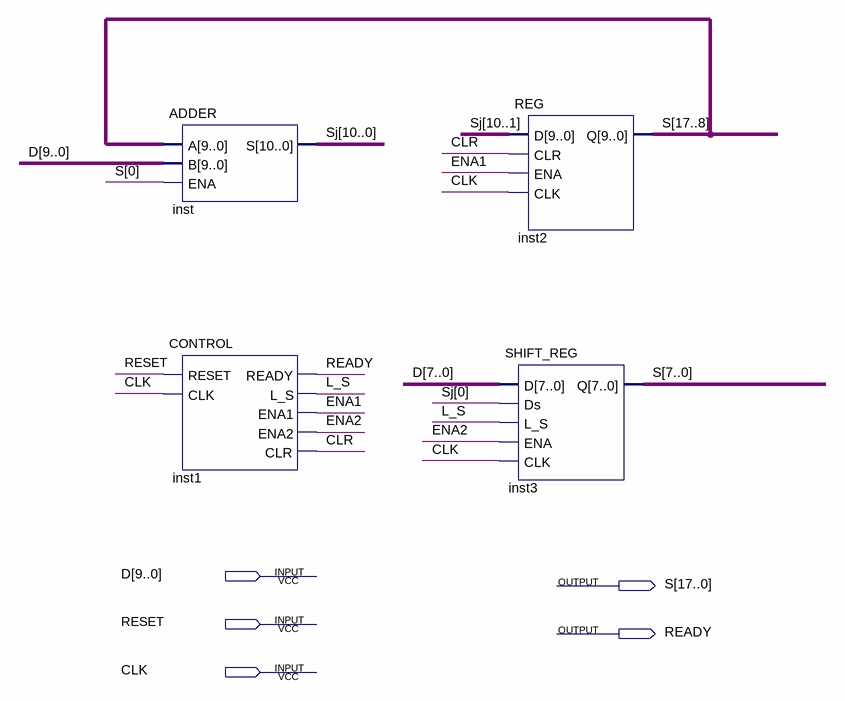
[diagram p0: schematic sheet]
// Quartus schematic mul_A_vs_B_custom.bdf as structural Verilog: 4 symbols, 5 pins
module mul_A_vs_B_custom (
  input  [9:0] D,
  input  RESET,
  input  CLK,
  output [17:0] S,
  output READY
);

  wire CLR, ENA1, ENA2, L_S;
  wire [10:0] Sj;

  ADDER inst (.A(S[17:8]), .B(D), .ENA(S[0]), .S(Sj));
  CONTROL inst1 (.RESET(RESET), .CLK(CLK), .READY(READY), .L_S(L_S), .ENA1(ENA1), .ENA2(ENA2), .CLR(CLR));
  REG inst2 (.D(Sj[10:1]), .CLR(CLR), .ENA(ENA1), .CLK(CLK), .Q(S[17:8]));
  SHIFT_REG inst3 (.D(D[7:0]), .Ds(Sj[0]), .L_S(L_S), .ENA(ENA2), .CLK(CLK), .Q(S[7:0]));
endmodule
